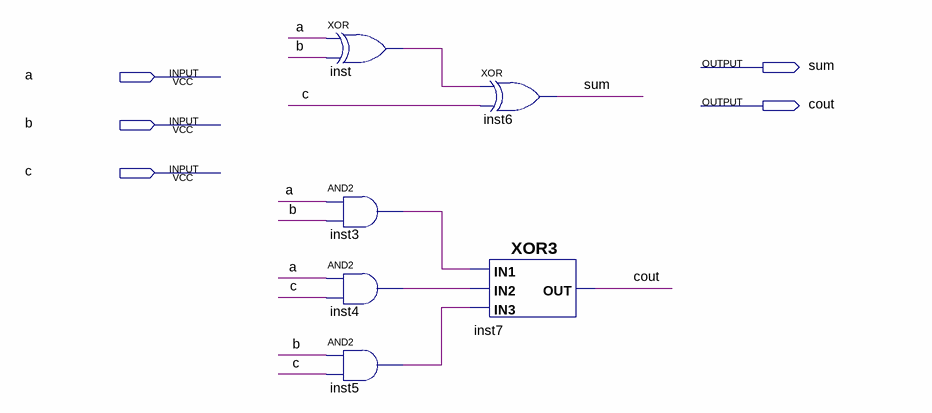
[diagram p0: schematic sheet]
// Quartus schematic full_adder.bdf as structural Verilog: 6 symbols, 5 pins
module full_adder (
  input  a,
  input  b,
  input  c,
  output sum,
  output cout
);

  wire inst3_out, inst4_out, inst5_out, inst_out;

  xor inst (inst_out, a, b);
  and inst3 (inst3_out, a, b);
  and inst4 (inst4_out, a, c);
  and inst5 (inst5_out, b, c);
  xor inst6 (sum, inst_out, c);
  XOR3 inst7 (.IN3(inst5_out), .IN1(inst3_out), .IN2(inst4_out), .OUT(cout));
endmodule
